# Altium schematic sheet SBRadio.SchDoc
size A4; PageSetup: Record=PageOptions|CenterHorizontal=True|CenterVertical=True|PrintScale=1.00|XCorrection=1.00|YCorrection=1.00|PrintKind=1|BorderSize=5000000|LeftOffset=0|BottomOffset=0|Orientation=2|PaperLength=1000|PaperWidth=1000|Scale=100|PaperSource=7|PrintQuality=-3|MediaType=1|DitherType=10|PrintScaleMode=1|PaperKind=A4|PaperIndex=9
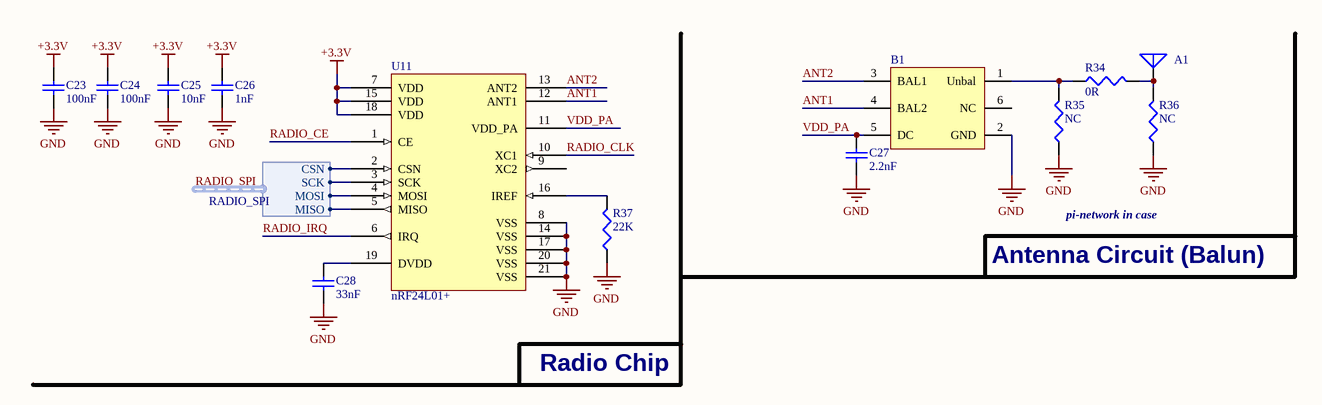
[diagram p0: SBRadio.SchDoc]

## Parts
A1  2450AT18D0100  [2450AT18D0100]  (value not drawn)
B1  2450BM14A0002T  [2450BM14A0002]  (value not drawn)
C23  100nF  [0402]
C24  100nF  [0402]
C25  10nF  [0402]
C26  1nF  [0402]
C27  2.2nF  [0402]
C28  33nF  [0402]
R34  0R  [0402]
R35  value NC  [0402 - NOBODY]  (hidden comment: 0402-NC)
R36  value NC  [0402 - NOBODY]  (hidden comment: 0402-NC)
R37  value 22K  [0402]  (hidden comment: 22K 0402 1/16W ±1%)
U11  nRF24L01+  [QFN50P400X400X95_HS-21L]

## Harnesses
RADIO_SPI: MOSI, MISO, SCK, CSN

## Nets
+3.3V: C23.2 C24.2 C25.2 C26.2 U11.7(VDD) U11.15(VDD) U11.18(VDD)
GND: A1.2(GND) B1.2(GND) C23.1 C24.1 C25.1 C26.1 C27.1 C28.1 R35.1 R36.1 R37.1 U11.8(VSS) U11.14(VSS) U11.17(VSS) U11.20(VSS) U11.21(VSS)
ANT1: B1.4(BAL2) U11.12(ANT1)
ANT2: B1.3(BAL1) U11.13(ANT2)
RADIO_CE: U11.1(CE)
RADIO_CLK: U11.10(XC1)
RADIO_IRQ: U11.6(IRQ)
RADIO_SPI.CSN: U11.2(CSN) ; harness RADIO_SPI.CSN
RADIO_SPI.MISO: U11.5(MISO) ; harness RADIO_SPI.MISO
RADIO_SPI.MOSI: U11.4(MOSI) ; harness RADIO_SPI.MOSI
RADIO_SPI.SCK: U11.3(SCK) ; harness RADIO_SPI.SCK
VDD_PA: B1.5(DC) C27.2 U11.11(VDD_PA)
NetA1_1: A1.1(A) R34.2 R36.2
NetB1_1: B1.1(Unbal) R34.1 R35.2
NetC28_2: C28.2 U11.19(DVDD)
NetR37_2: R37.2 U11.16(IREF)

Not connected (* = marked no-connect by the designer): B1 6(NC); U11 9(XC2)

## Notes on the sheet
- pi-network in case
- Antenna Circuit (Balun)
- Radio Chip

## Library data of the parts
A1 = 2450AT18D0100: JOHANSON TECHNOLOGY 2450AT18D0100  ANTENNA, CERAMIC, 2.45GHZ; Supplier 1: Mouser; Supplier 2: Digi-Key; Supplier Part Number 1: 609-2450AT18D0100E; Supplier Part Number 2: 712-1573-1-ND
B1 = 2450BM14A0002T: Johanson Technology Impedance Matched Balun Filter Integrated Passive for nRF24L01; Supplier 1: Farnell; Supplier 2: Digi-Key; Supplier Part Number 1: 2148533; Supplier Part Number 2: 712-1574-1-ND
C23 C24 = 100nF: 100nF 0402 X7R 16V ±10%; Supplier 1: Farnell; Supplier Part Number 1: 1288252; Supplier 2: Digi-Key; Supplier Part Number 2: 399-3521-1-ND; Value: 100nF
C25 = 10nF: 10nF 0402 X7R 25V ±5%; Supplier 1: Farnell; Supplier Part Number 1: 1692285; Supplier 2: Digi-Key; Supplier Part Number 2: 399-1279-1-ND; Value: 10nF
C26 = 1nF: 1nF 0402 X7R 50V ±10%; Supplier 1: Farnell; Supplier 2: Digi-Key; Supplier Part Number 1: 1414573; Supplier Part Number 2: 399-1032-1-ND; Value: 1nF
C27 = 2.2nF: 2.2nF 0402 X7R 50V ±10%; Supplier 1: Farnell; Supplier 2: Digi-Key; Supplier Part Number 1: 1414582; Supplier Part Number 2: 399-3068-1-ND; Value: 2.2nF
C28 = 33nF: 33nF 0402 X7R 50V ±10%; Supplier 1: Farnell; Supplier 2: Digi-Key; Supplier Part Number 1: 2210826; Supplier Part Number 2: 445-7334-1-ND; Value: 33nF
R34 = 0R: 0R 0402 1/16W ±0.05R; Supplier 1: Farnell; Supplier 2: Digi-Key; Supplier Part Number 1: 2072513; Supplier Part Number 2: P0.0JCT-ND; Value: 0R
R35 R36 = 0402-NC: NOT CONNECTED
R37 = 22K: Supplier 1: Farnell; Supplier 2: Digi-Key; Supplier Part Number 1: 2072781; Supplier Part Number 2: 541-22.0KLCT-ND
U11 = nRF24L01+: Nordic Semi Ultra low power 2.4GHz RF Transceiver IC; Supplier 1: Digi-Key; Supplier Part Number 1: 1490-1033-1-ND